# EasyEDA schematic SCH_Solder_2025-04-27 (2).json
TITLE: Sheet_1; REV: 1.0; Date: 2025-04-27; Sheet: 1/1; Drawn By: adarsh2203; Company: Your Company
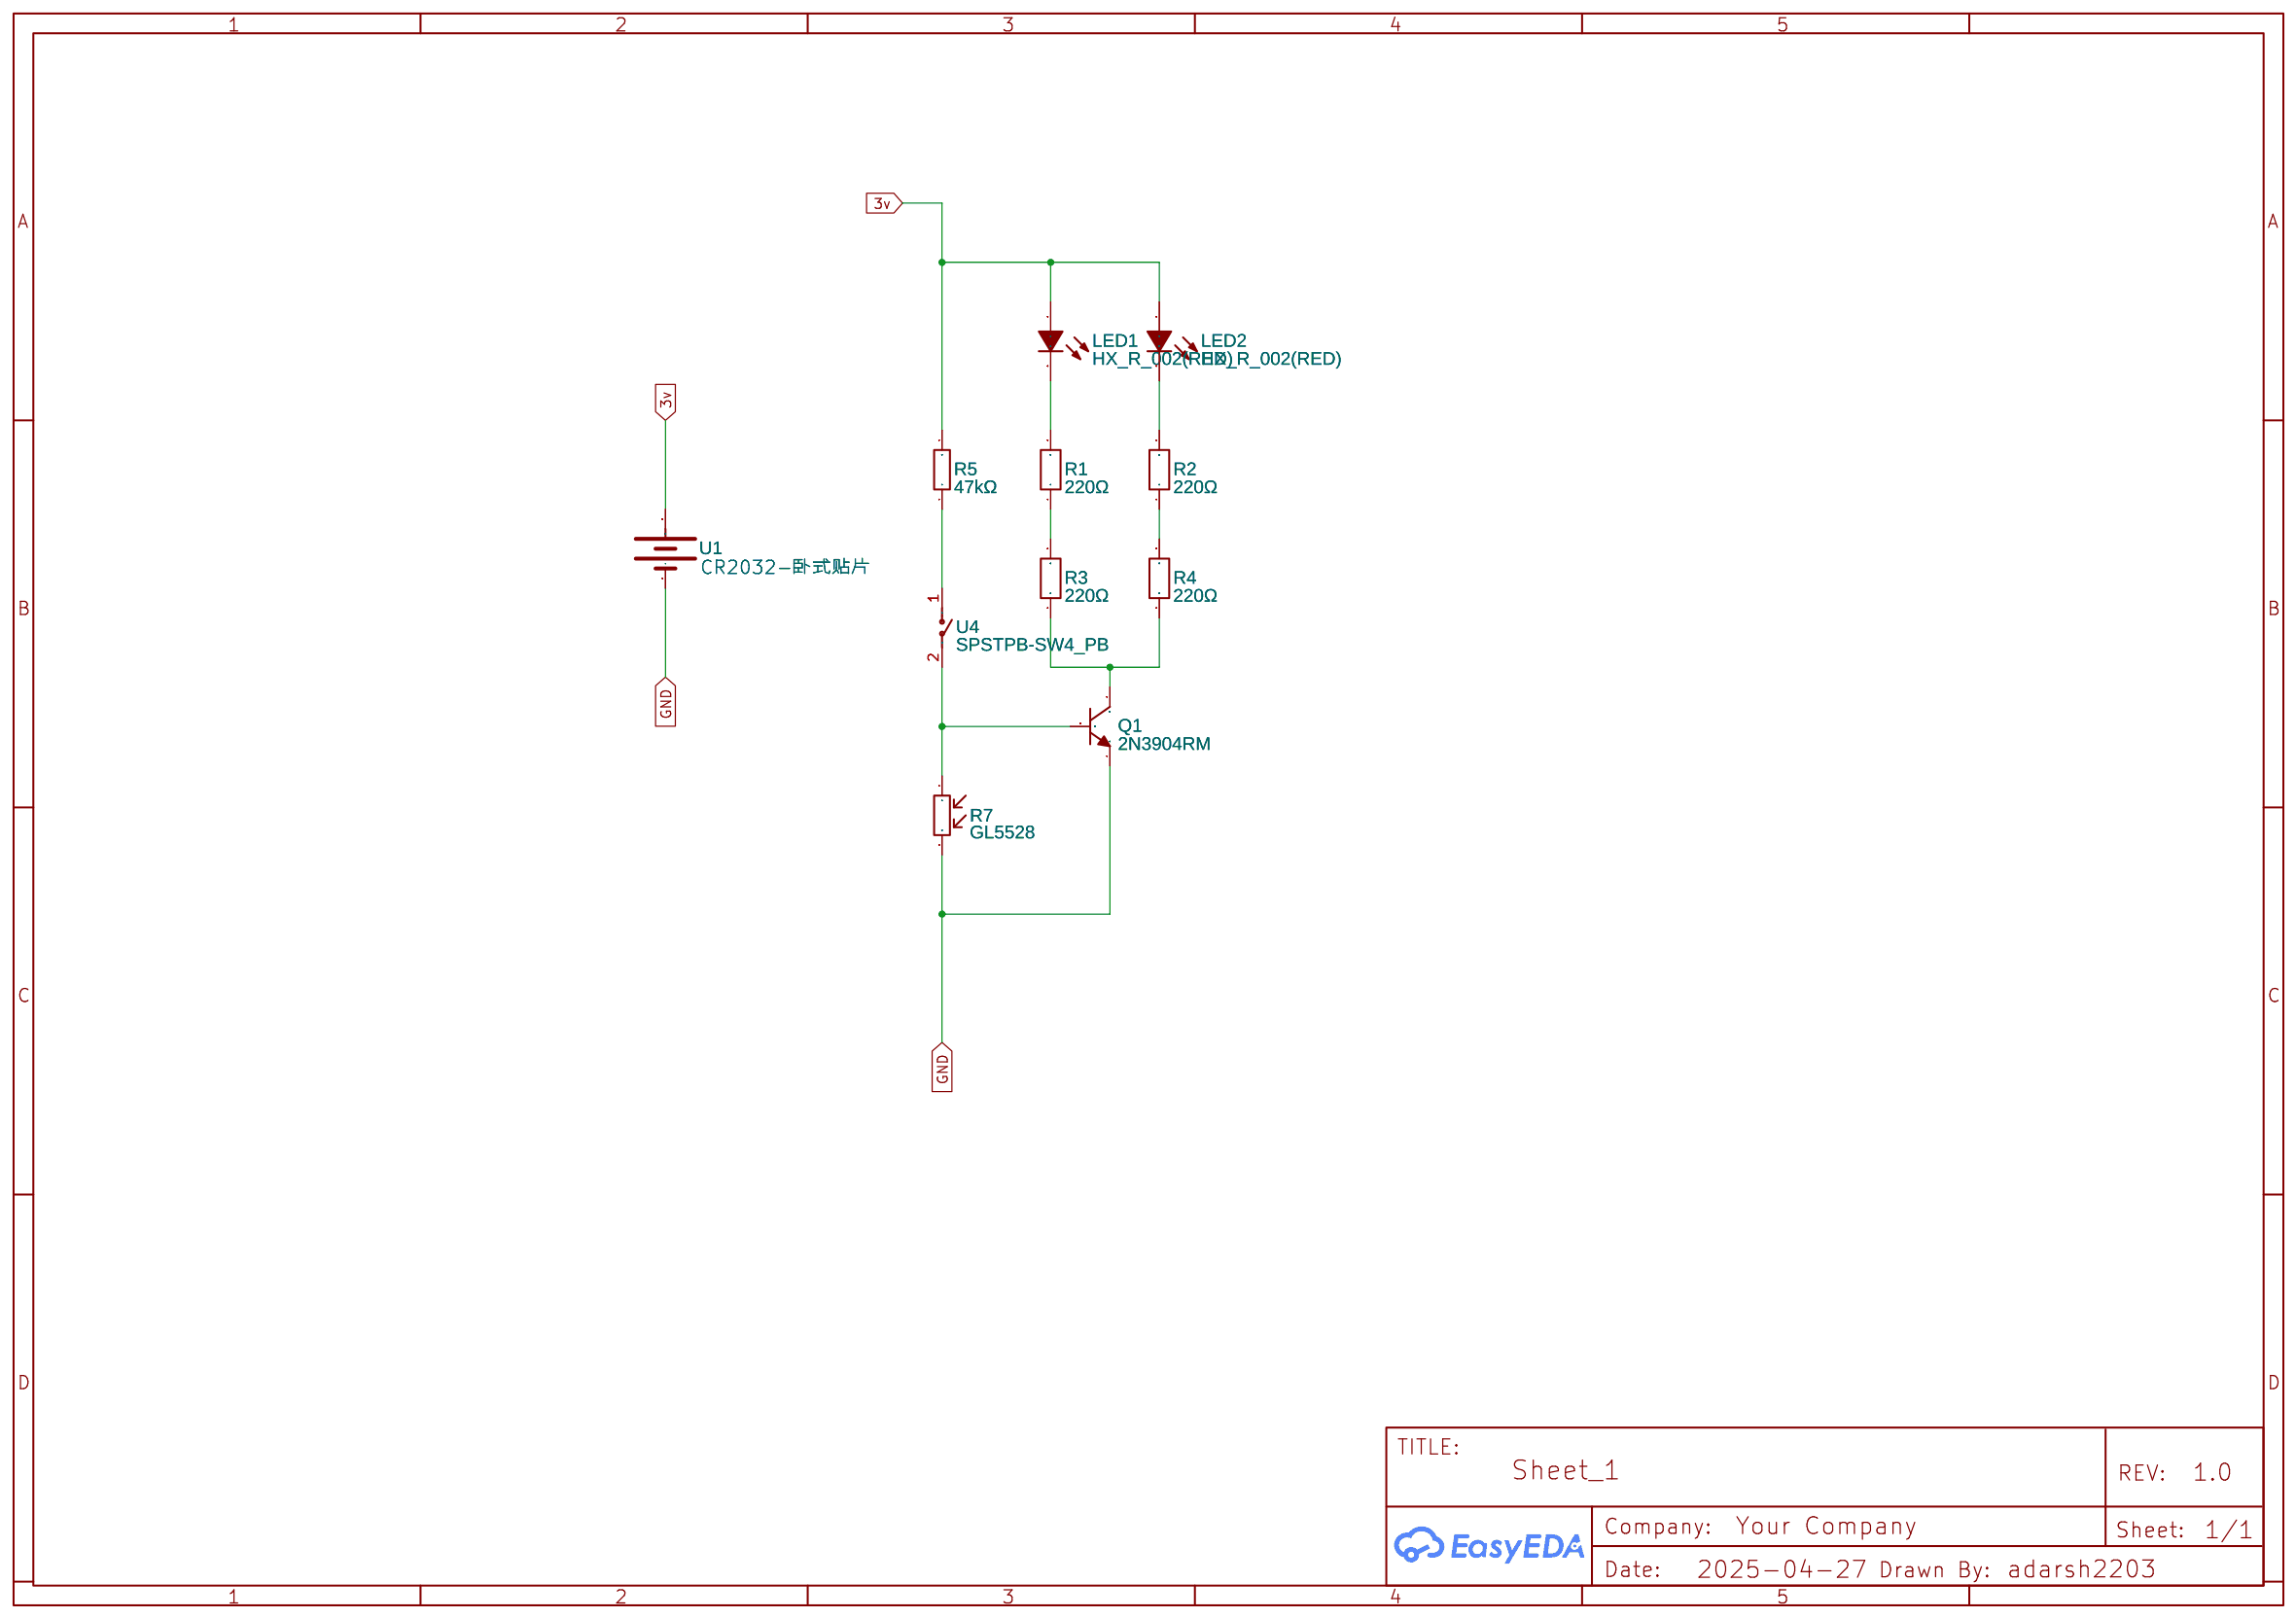
[diagram p0: schematic sheet]

## Parts
LED1  HX_R_002(RED)  [LED0603-R-RD_RED]
LED2  HX_R_002(RED)  [LED0603-R-RD_RED]
Q1  2N3904RM  [TO-92-3_L4.8-W3.7-P1.27-L]
R1  220Ω  [R0805]
R2  220Ω  [R0805]
R3  220Ω  [R0805]
R4  220Ω  [R0805]
R5  47kΩ  [R0603]
R7  GL5528  [RES-TH_L5.1-W4.3-P3.40-D0.5]
U1  CR2032-卧式贴片  [BAT-SMD_CR2032-C9900005595]
U4  SPSTPB-SW4_PB  [KEY-SMD_L6.2-W3.6-LS8.0]

## Library data of the parts
LED1 LED2 = HX_R_002(RED): Contributor: LCSC; Supplier: LCSC; Supplier Part: C9900010499; Manufacturer: null; JLCPCB Part Class: Extended Part
Q1 = 2N3904RM: Supplier: LCSC; Supplier Part: C3201796; Manufacturer: onsemi(安森美); JLCPCB Part Class: Extended Part; Contributor: lcsc
R1-R4 = CR0805J220RP05Z: Contributor: LCSC; Supplier: LCSC; Supplier Part: C881343; Manufacturer: EVER OHMS(天二科技); JLCPCB Part Class: Extended Part
R5 = 0603WAJ0473T5E: Supplier: LCSC; Manufacturer: UNI-ROYAL(厚声); Supplier Part: C25600; JLCPCB Part Class: Extended Part
R7 = GL5528: Supplier: LCSC; Manufacturer: 森霸; Supplier Part: C125627; JLCPCB Part Class: Extended Part
U1 = CR2032-卧式贴片: Contributor: LCSC; Supplier: LCSC; Supplier Part: C9900005595; Manufacturer: null; JLCPCB Part Class: Extended Part
U4 = SPSTPB-SW4_PB: Contributor: LCSC; Supplier: LCSC; Supplier Part: C9900005296; Manufacturer: null

## Nets
3v: LED1.1(A) LED2.1(A) R5.2 U1.2(+)
GND: Q1.1(E) R7.2 U1.1(-)
Net-(LED1-2): LED1.2(C) R1.2
Net-(LED2-2): LED2.2(C) R2.2
Net-(Q1-2): Q1.2(B) R7.1 U4.2
Net-(Q1-3): Q1.3(C) R3.1 R4.1
Net-(R1-1): R1.1 R3.2
Net-(R2-1): R2.1 R4.2
Net-(R5-1): R5.1 U4.1
